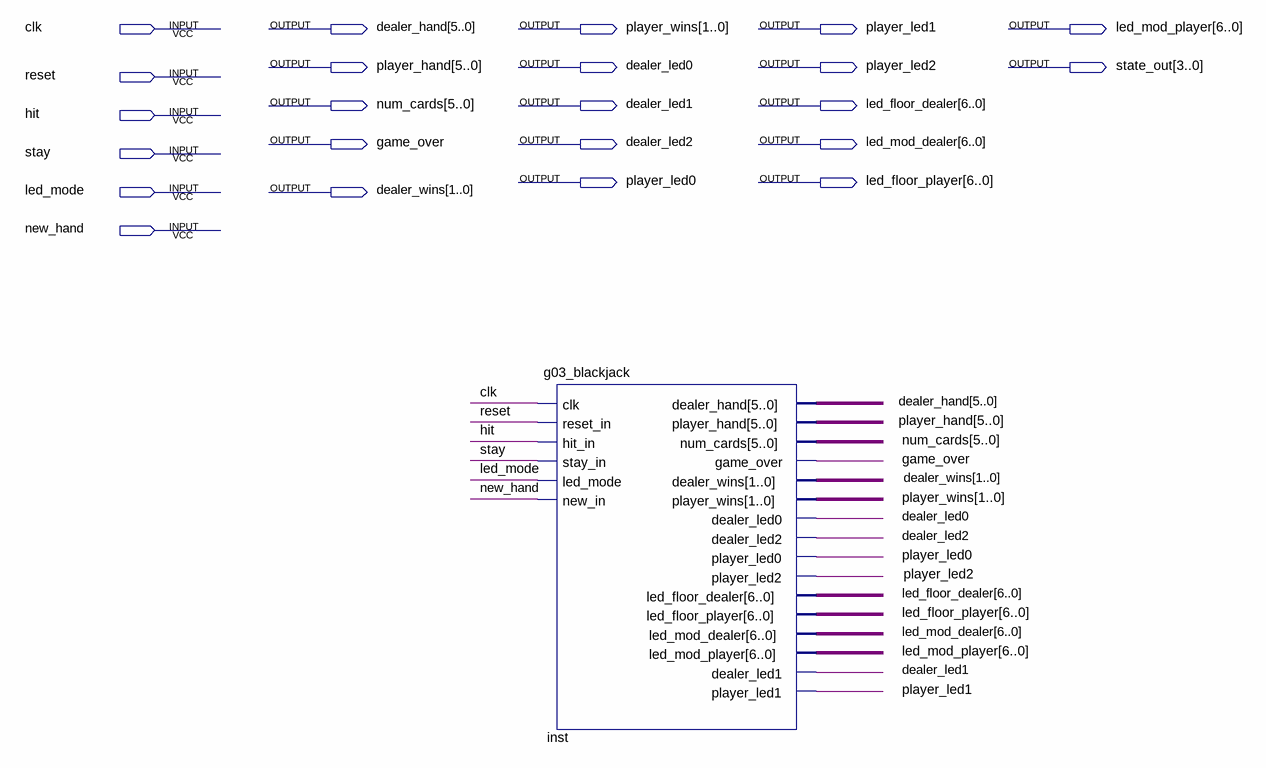
[diagram p0: schematic sheet]
// Quartus schematic g03_lab5.bdf as structural Verilog: 1 symbols, 23 pins
module g03_lab5 (
  input  clk,
  input  reset,
  input  hit,
  input  stay,
  input  led_mode,
  input  new_hand,
  output [5:0] dealer_hand,
  output [1:0] player_wins,
  output player_led1,
  output [6:0] led_mod_player,
  output [5:0] player_hand,
  output dealer_led0,
  output player_led2,
  output [3:0] state_out,
  output [5:0] num_cards,
  output dealer_led1,
  output [6:0] led_floor_dealer,
  output game_over,
  output dealer_led2,
  output [6:0] led_mod_dealer,
  output player_led0,
  output [6:0] led_floor_player,
  output [1:0] dealer_wins
);

  g03_blackjack inst (
    .clk(clk), .reset_in(reset), .hit_in(hit), .stay_in(stay), .led_mode(led_mode), .new_in(new_hand),
    .dealer_hand(dealer_hand), .player_hand(player_hand), .num_cards(num_cards), .game_over(game_over),
    .dealer_wins(dealer_wins), .player_wins(player_wins), .dealer_led0(dealer_led0),
    .dealer_led2(dealer_led2), .player_led0(player_led0), .player_led2(player_led2),
    .led_floor_dealer(led_floor_dealer), .led_floor_player(led_floor_player),
    .led_mod_dealer(led_mod_dealer), .led_mod_player(led_mod_player), .dealer_led1(dealer_led1),
    .player_led1(player_led1));
endmodule
